# Altium schematic sheet MainSheet.SchDoc: Persistence of Vision
size A4; Author: Nyiri Levente; Organization: BME_AUT; DocumentNumber: 1; Revision: 29; SheetNumber: 1; SheetTotal: 3
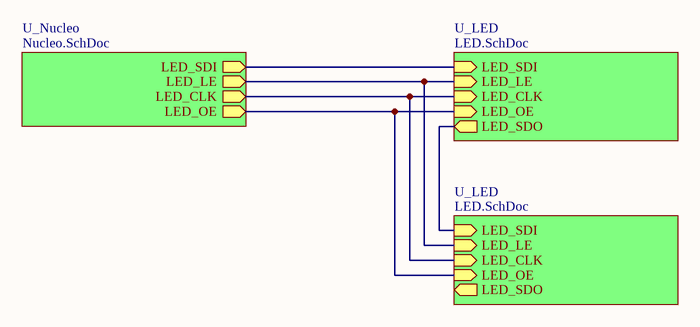
[diagram p0: MainSheet.SchDoc]

## Sub-sheets
U_LED = LED.SchDoc: LED_OE (in), LED_LE (in), LED_CLK (in), LED_SDI (in), LED_SDO (out)
U_LED = LED.SchDoc: LED_OE (in), LED_LE (in), LED_CLK (in), LED_SDI (in), LED_SDO (out)
U_Nucleo = Nucleo.SchDoc: LED_OE (out), LED_LE (out), LED_SDI (out), LED_CLK (out)

## Nets
(unnamed): sheet U_Nucleo/LED_OE, sheet U_LED/LED_OE, sheet U_LED/LED_OE
(unnamed): sheet U_Nucleo/LED_LE, sheet U_LED/LED_LE, sheet U_LED/LED_LE
(unnamed): sheet U_Nucleo/LED_SDI, sheet U_LED/LED_SDI
(unnamed): sheet U_Nucleo/LED_CLK, sheet U_LED/LED_CLK, sheet U_LED/LED_CLK
(unnamed): sheet U_LED/LED_SDO, sheet U_LED/LED_SDI

## Notes on the sheet
- Title
- Size:
- Date:
- A4
- Number:
- Time:
- Revision:
- Sheet
- of
- File: